# Altium schematic sheet driver_V1.1âSchDoc.SchDoc
size A4
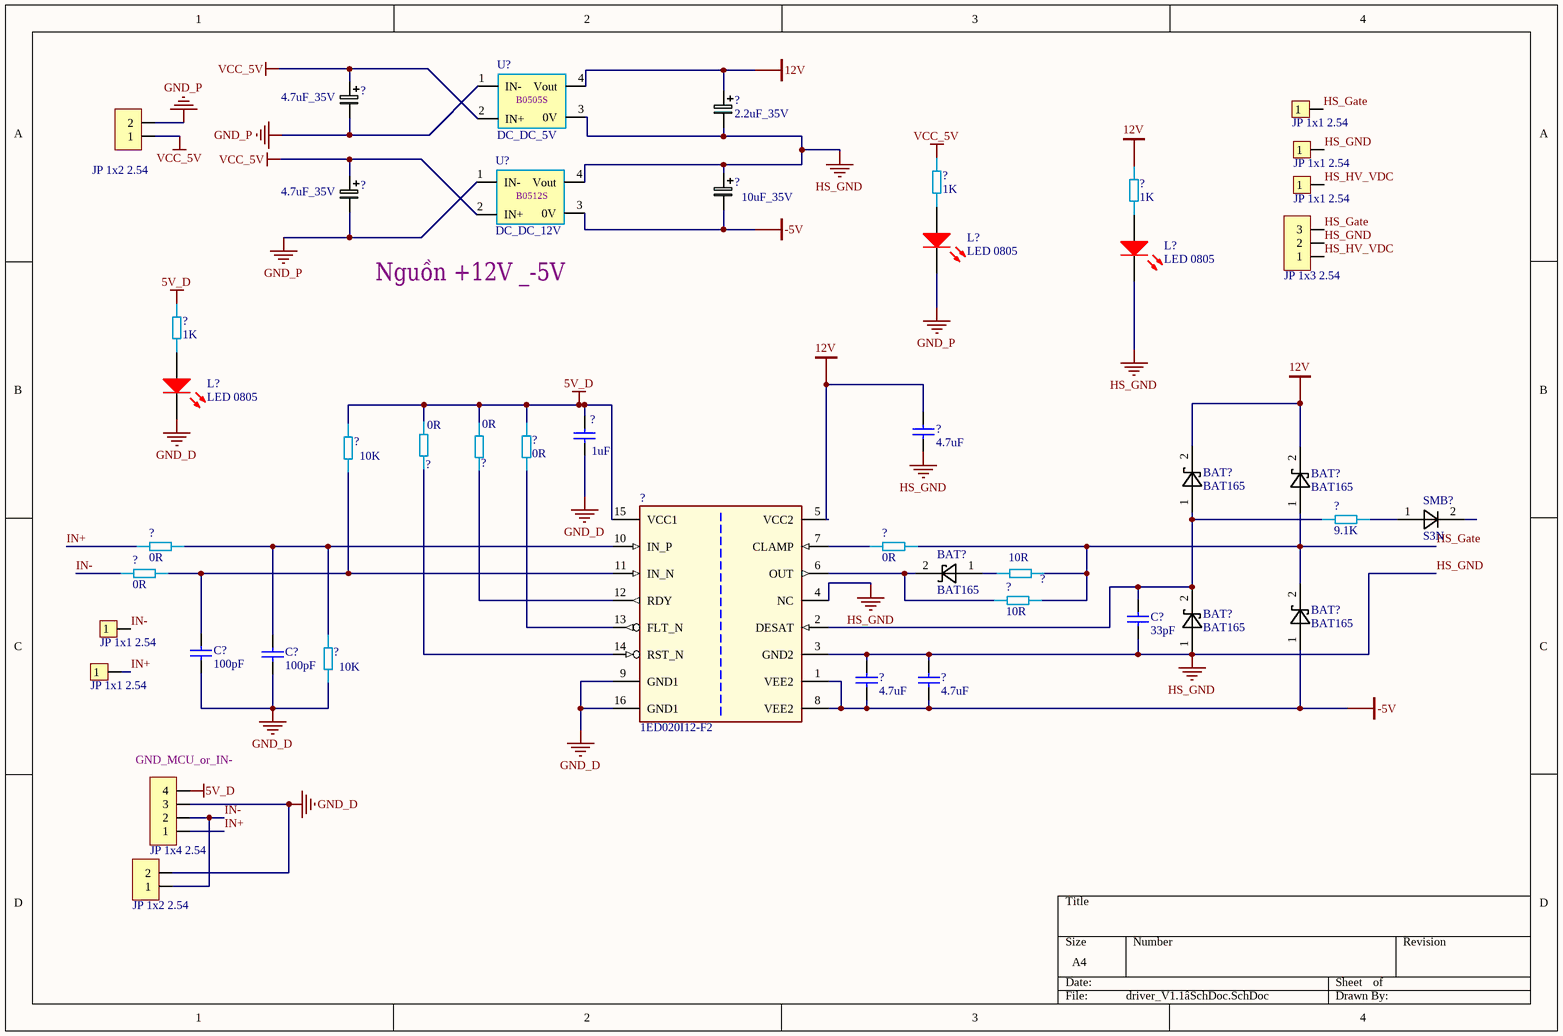
[diagram p0: driver_V1.1âSchDoc.SchDoc]

## Parts
(Parts that share a designator on the sheet are numbered #1, #2 ... from top to bottom, then left to right.)
?#1  4.7uF_35V  [tu_4x5.4mm]
?#2  2.2uF_35V  [tu_4x5.4mm]
?#3  1K  [RES1206]
?#4  1K  [RES1206]
?#5  4.7uF_35V  [tu_4x5.4mm]
?#6  10uF_35V  [tu_4x5.4mm]
?#7  1K  [RES1206]
?#8  4.7uF  [tu 1206_N]
?#9  1uF  [Tu 0805_N]
?#10  0R  [RES1206]
?#11  0R  [RES1206]
?#12  0R  [RES1206]
?#13  10K  [RES1206]
?#14  1ED020I12-F2  [SOIC127P1028X264-16N-1]
?#15  9.1K  [RES_2512]
?#16  0R  [RES1206]
?#17  0R  [RES_2512]
?#18  0R  [RES1206]
?#19  10R  [RES_2512]
?#20  10R  [RES_2512]
?#21  10K  [RES1206]
?#22  4.7uF  [tu 1206_N]
?#23  4.7uF  [tu 1206_N]
BAT?#1  BAT165  [SMB]
BAT?#2  BAT165  [SMB]
BAT?#3  BAT165  [SMB]
BAT?#4  BAT165  [SMB]
BAT?#5  BAT165  [SMB]
C?#1  33pF  [Tu 0805_N]
C?#2  100pF  [Tu 0805_N]
C?#3  100pF  [Tu 0805_N]
JP?#1  JP 1x1 2.54  [test_point]
JP?#2  JP 1x2 2.54  [JP 1x2 DT_n]
JP?#3  JP 1x1 2.54  [test_point]
JP?#4  JP 1x1 2.54  [test_point]
JP?#5  JP 1x3 2.54  [XH2.54M-3]
JP?#6  JP 1x1 2.54  [test_point]
JP?#7  JP 1x1 2.54  [test_point]
JP?#8  JP 1x4 2.54  [XH2.54M-4]
JP?#9  JP 1x2 2.54  [XH2.54M-2]
L?#1  LED 0805  [LED-0805-Red]
L?#2  LED 0805  [LED-0805-Red]
L?#3  LED 0805  [LED-0805-Red]
SMB?  S3N  [SMB]
U?#1  DC_DC_5V  [B0505S/D-1W]
U?#2  DC_DC_12V  [B0512S/D-1W]

## Nets
5V_D: ?#7.1 ?#9.2 ?#10.2 ?#11.1 ?#12.1 ?#13.2 ?#14.15(VCC1) JP?#8.4
12V: ?#2.1 ?#4.1 ?#8.2 ?#14.5(VCC2) BAT?#1.2 BAT?#2.2 U?#1.4(Vout)
-5V: ?#6.2 ?#14.1(VEE2) ?#14.8(VEE2) ?#22.1 ?#23.1 BAT?#5.1 U?#2.3(0V)
GND_D: ?#9.1 ?#14.9(GND1) ?#14.16(GND1) ?#21.1 C?#2.1 C?#3.1 JP?#8.3 JP?#9.2 L?#3.2(K)
GND_P: ?#1.2 ?#5.2 JP?#2.2 L?#1.2(K) U?#1.1(IN-) U?#2.1(IN-)
HS_GND: ?#2.2 ?#6.1 ?#8.1 ?#14.3(GND2) ?#14.4(NC) ?#22.2 ?#23.2 BAT?#4.1 C?#1.1 JP?#3.1 JP?#5.2 L?#2.2(K) U?#1.3(0V) U?#2.4(Vout)
VCC_5V: ?#1.1 ?#3.1 ?#5.1 JP?#2.1 U?#1.2(IN+) U?#2.2(IN+)
HS_Gate: ?#17.2 ?#19.2 ?#20.2 BAT?#2.1 BAT?#5.2 JP?#1.1 JP?#5.3
HS_HV_VDC: JP?#4.1 JP?#5.1
IN+: ?#16.2 JP?#7.1 JP?#8.1
IN-: ?#18.2 JP?#6.1 JP?#8.2 JP?#9.1
Net?#3_2: ?#3.2 L?#1.1(A)
Net?#4_2: ?#4.2 L?#2.1(A)
Net?#7_2: ?#7.2 L?#3.1(A)
Net?#10_1: ?#10.1 ?#14.14(RST_N)
Net?#11_2: ?#11.2 ?#14.12(RDY)
Net?#12_2: ?#12.2 ?#14.13(FLT_N)
Net?#13_1: ?#13.1 ?#14.11(IN_N) ?#18.1 C?#2.2
Net?#14_2: ?#14.2(DESAT) ?#15.1 BAT?#1.1 BAT?#4.2 C?#1.2
Net?#14_6: ?#14.6(OUT) ?#20.1 BAT?#3.2
Net?#14_7: ?#14.7(CLAMP) ?#17.1
Net?#14_10: ?#14.10(IN_P) ?#16.1 ?#21.2 C?#3.2
Net?#15_2: ?#15.2 SMB?.1
Net?#19_1: ?#19.1 BAT?#3.1

Not connected (* = marked no-connect by the designer): SMB? 2

## Notes on the sheet
- Nguồn +12V _-5V
- (near JP?#8) GND_MCU_or_IN-
- (in symbol DC_DC_5v) B0505S
- (in symbol DC_DC_12v) B0512S

## Library data of the parts
?#1 ?#2 ?#5 ?#6 = capacitor_electric
?#3 ?#4 ?#7 ?#10-?#13 ?#15-?#21 = 311-0.0GRTR-ND
?#8 ?#22 ?#23 = cap_1210
?#9 C?#1-C?#3 = cap_0805
?#14 = 1ED020I12-F2: Single IGBT Driver IC; Manufacturer: Infineon Technologies; Manufacturer Order Number: 1ED020I12-F2; PackageReference: PG-DSO-16-15
JP?#1 JP?#3 JP?#4 JP?#6 JP?#7 = JP 1x1 2.54 Duc Thang: Cắm; Ten_Linh_Kien: Jump Đơn Đực 2.54MM 1x40P Thẳng 11MM; Don_Vi: Con; Ma_Hang: MH000903; Ghi_Chu: *; Kieu_Chan: *; Chung_Loai: Cắm
JP?#2 JP?#9 = JP 1x2 2.54 Duc Thang: Cắm; Ten_Linh_Kien: Jump Đơn Đực 2.54MM 1x40P Thẳng 11MM; Don_Vi: Con; Ma_Hang: MH000903; Ghi_Chu: *; Kieu_Chan: *; Chung_Loai: Cắm
JP?#5 = JP 1x3 2.54 Duc Cong: Cắm; Ten_Linh_Kien: Jump Đơn Đực 2.54MM 1x40P Cong Đứng; Don_Vi: Con; Ma_Hang: MH000904; Ghi_Chu: *; Kieu_Chan: *; Chung_Loai: Cắm
JP?#8 = JP 1x4 2.54 Duc Thang: Cắm; Ten_Linh_Kien: Jump Đơn Đực 2.54MM 1x40P Thẳng 11MM; Don_Vi: Con; Ma_Hang: MH000903; Ghi_Chu: *; Kieu_Chan: *; Chung_Loai: Cắm
L?#1-L?#3 = LED 0805 Do: Dán; Don_Vi: Con; Ma_Hang: MH000897; Ten_Linh_Kien: LED 0805 Màu Đỏ (Red); Ghi_Chu: *; Kieu_Chan: *; Chung_Loai: Dán
SMB? = S3A-S3N